# Altium schematic sheet AUAV_X05_PMW3901.SchDoc
size 209 x 148 mm
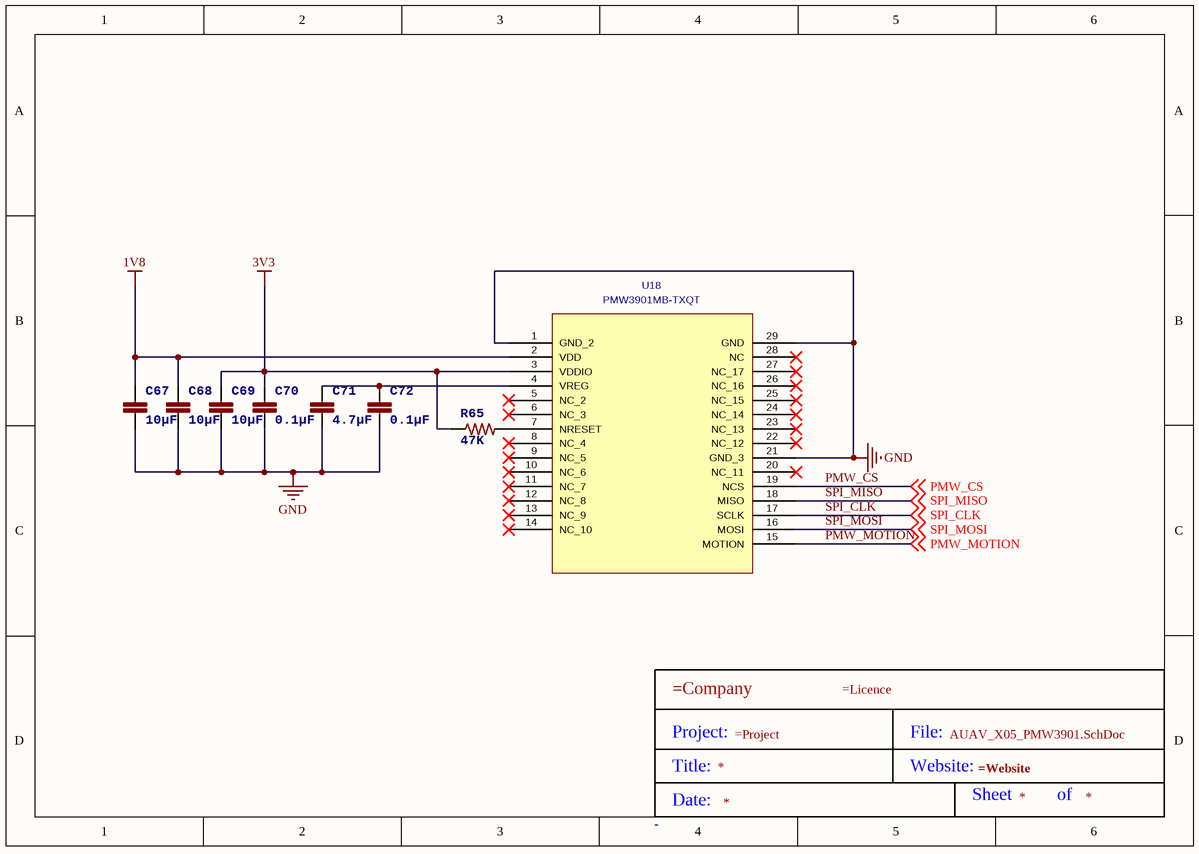
[diagram p0: AUAV_X05_PMW3901.SchDoc]

## Parts
*?  Title Block  (value not drawn)
C67  10µF  [0805-CAP]
C68  10µF  [0805-CAP]
C69  10µF  [0805-CAP]
C70  0.1µF  [0402-CAP]
C71  4.7µF  [0603-CAP]
C72  0.1µF  [0402-CAP]
R65  47K  [0402-RES]
U18  PMW3901MB-TXQT  [QFN_01MB-TXQT_PI]

## Nets
1V8: C67.P$1 C68.P$1 U18.2(VDD)
3V3: C69.P$1 C70.P$1 R65.P$1 U18.3(VDDIO)
GND: C67.P$2 C68.P$2 C69.P$2 C70.P$2 C71.P$2 C72.P$2 U18.1(GND_2) U18.21(GND_3) U18.29(GND)
PMW_CS: U18.19(NCS) ; off-sheet PMW_CS
PMW_MOTION: U18.15(MOTION) ; off-sheet PMW_MOTION
SPI_CLK: U18.17(SCLK) ; off-sheet SPI_CLK
SPI_MISO: U18.18(MISO) ; off-sheet SPI_MISO
SPI_MOSI: U18.16(MOSI) ; off-sheet SPI_MOSI
NetC71_P$1: C71.P$1 C72.P$1 U18.4(VREG)
NetR65_P$2: R65.P$2 U18.7(NRESET)

Not connected (* = marked no-connect by the designer): U18 5(NC_2)* 6(NC_3)* 8(NC_4)* 9(NC_5)* 10(NC_6)* 11(NC_7)* 12(NC_8)* 13(NC_9)* 14(NC_10)* 20(NC_11)* 22(NC_12)* 23(NC_13)* 24(NC_14)* 25(NC_15)* 26(NC_16)* 27(NC_17)* 28(NC)*

## Notes on the sheet
- (in symbol Title Block) Project:; File:; Title:; Website:; Sheet; of; Date:

## Library data of the parts
C67-C69 = CAP0805: CAP CER 4.7UF 16V 10% X7R 0805; PARTNO: CL21B475KOFNNNE; 3DR_PARTNO: ECM0622; Value: 4u7; DATASHEET: http://www.digikey.com/product-detail/en/CL21B475KOFNNNE/1276-2873-2-ND/3888531; Supplier 1: Digi-Key; Supplier Part Number 1: 1276-2873-1-ND
C70 C72 = CAP0402: CAP CER 8PF 50V C0G 0402; PARTNO: C1005C0G1H080C; 3DR_PARTNO: ECM0710; Value: 8p; Supplier 1: Digi-Key; Supplier Part Number 1: 445-4890-1-ND
C71 = CAP0603: CAP CER 2.2UF 16V 10% X6S 0603; PARTNO: C1608X6S1C225K080AC; 3DR_PARTNO: ECM0619; Value: 2u2; Supplier 1: Digi-Key; Supplier Part Number 1: 445-7438-1-ND
R65 = RESISTOR0402-RES: RES 10K OHM 1/16W 1% 0402 SMD; PARTNO: RC0402FR-0710KL; 3DR_PARTNO: ECM0800; Supplier 1: Digi-Key; Value: 10K; Supplier Part Number 1: 311-10.0KLRCT-ND
U18 = PMW3901MB-TXQT: Mfr_Name: PixArt; C: Copyright (C) 2018 Accelerated Designs. All rights reserved; Value: PMW3901MB-TXQT; Copyright: Copyright (C) 2022 Ultra Librarian. All rights reserved.; Manufacturer_Part_Number: PMW3901MB-TXQT
*? = Title Block: Size: -